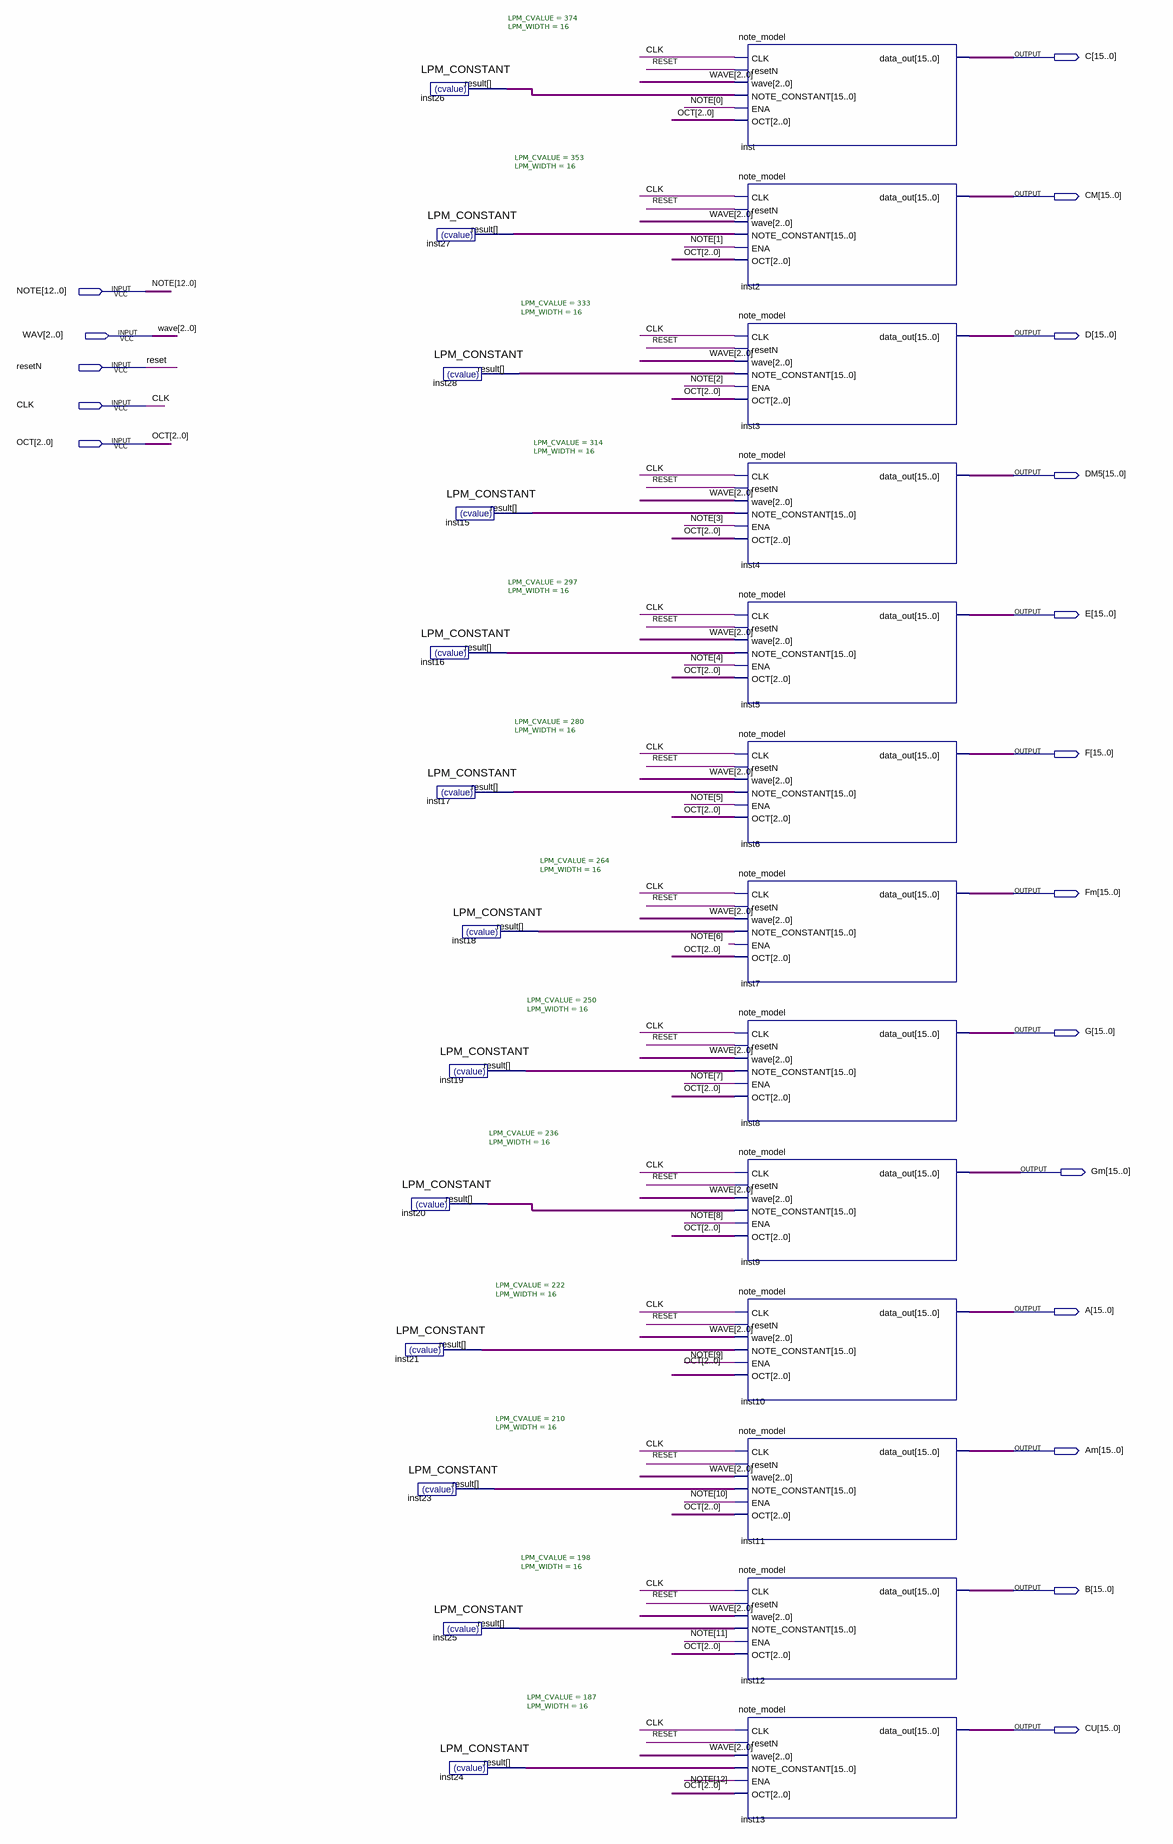
[diagram p0: schematic sheet]
// Quartus schematic PIANO_MOD_NEW.bdf as structural Verilog: 26 symbols, 18 pins
module PIANO_MOD_NEW (
  input  [12:0] NOTE,
  input  [2:0] WAV,
  input  resetN,
  input  CLK,
  input  [2:0] OCT,
  output [15:0] C,
  output [15:0] CM,
  output [15:0] D,
  output [15:0] DM5,
  output [15:0] E,
  output [15:0] F,
  output [15:0] Fm,
  output [15:0] G,
  output [15:0] Gm,
  output [15:0] A,
  output [15:0] Am,
  output [15:0] B,
  output [15:0] CU
);

  wire [15:0] inst15_result, inst16_result, inst17_result, inst18_result, inst19_result, inst20_result,
       inst21_result, inst23_result, inst24_result, inst25_result, inst26_result, inst27_result,
       inst28_result;

  LPM_CONSTANT #(.LPM_CVALUE(374), .LPM_WIDTH(16)) inst26 (.result(inst26_result));
  LPM_CONSTANT #(.LPM_CVALUE(297), .LPM_WIDTH(16)) inst16 (.result(inst16_result));
  LPM_CONSTANT #(.LPM_CVALUE(236), .LPM_WIDTH(16)) inst20 (.result(inst20_result));
  LPM_CONSTANT #(.LPM_CVALUE(222), .LPM_WIDTH(16)) inst21 (.result(inst21_result));
  LPM_CONSTANT #(.LPM_CVALUE(210), .LPM_WIDTH(16)) inst23 (.result(inst23_result));
  LPM_CONSTANT #(.LPM_CVALUE(353), .LPM_WIDTH(16)) inst27 (.result(inst27_result));
  LPM_CONSTANT #(.LPM_CVALUE(333), .LPM_WIDTH(16)) inst28 (.result(inst28_result));
  LPM_CONSTANT #(.LPM_CVALUE(314), .LPM_WIDTH(16)) inst15 (.result(inst15_result));
  LPM_CONSTANT #(.LPM_CVALUE(280), .LPM_WIDTH(16)) inst17 (.result(inst17_result));
  LPM_CONSTANT #(.LPM_CVALUE(264), .LPM_WIDTH(16)) inst18 (.result(inst18_result));
  LPM_CONSTANT #(.LPM_CVALUE(250), .LPM_WIDTH(16)) inst19 (.result(inst19_result));
  LPM_CONSTANT #(.LPM_CVALUE(198), .LPM_WIDTH(16)) inst25 (.result(inst25_result));
  LPM_CONSTANT #(.LPM_CVALUE(187), .LPM_WIDTH(16)) inst24 (.result(inst24_result));
  note_model inst (
    .CLK(CLK), .resetN(resetN), .wave(WAV), .NOTE_CONSTANT(inst26_result), .ENA(NOTE[0]), .OCT(OCT),
    .data_out(C));
  note_model inst2 (
    .CLK(CLK), .resetN(resetN), .wave(WAV), .NOTE_CONSTANT(inst27_result), .ENA(NOTE[1]), .OCT(OCT),
    .data_out(CM));
  note_model inst3 (
    .CLK(CLK), .resetN(resetN), .wave(WAV), .NOTE_CONSTANT(inst28_result), .ENA(NOTE[2]), .OCT(OCT),
    .data_out(D));
  note_model inst4 (
    .CLK(CLK), .resetN(resetN), .wave(WAV), .NOTE_CONSTANT(inst15_result), .ENA(NOTE[3]), .OCT(OCT),
    .data_out(DM5));
  note_model inst5 (
    .CLK(CLK), .resetN(resetN), .wave(WAV), .NOTE_CONSTANT(inst16_result), .ENA(NOTE[4]), .OCT(OCT),
    .data_out(E));
  note_model inst6 (
    .CLK(CLK), .resetN(resetN), .wave(WAV), .NOTE_CONSTANT(inst17_result), .ENA(NOTE[5]), .OCT(OCT),
    .data_out(F));
  note_model inst7 (
    .CLK(CLK), .resetN(resetN), .wave(WAV), .NOTE_CONSTANT(inst18_result), .ENA(NOTE[6]), .OCT(OCT),
    .data_out(Fm));
  note_model inst8 (
    .CLK(CLK), .resetN(resetN), .wave(WAV), .NOTE_CONSTANT(inst19_result), .ENA(NOTE[7]), .OCT(OCT),
    .data_out(G));
  note_model inst9 (
    .CLK(CLK), .resetN(resetN), .wave(WAV), .NOTE_CONSTANT(inst20_result), .ENA(NOTE[8]), .OCT(OCT),
    .data_out(Gm));
  note_model inst10 (
    .CLK(CLK), .resetN(resetN), .wave(WAV), .NOTE_CONSTANT(inst21_result), .ENA(NOTE[9]), .OCT(OCT),
    .data_out(A));
  note_model inst11 (
    .CLK(CLK), .resetN(resetN), .wave(WAV), .NOTE_CONSTANT(inst23_result), .ENA(NOTE[10]), .OCT(OCT),
    .data_out(Am));
  note_model inst12 (
    .CLK(CLK), .resetN(resetN), .wave(WAV), .NOTE_CONSTANT(inst25_result), .ENA(NOTE[11]), .OCT(OCT),
    .data_out(B));
  note_model inst13 (
    .CLK(CLK), .resetN(resetN), .wave(WAV), .NOTE_CONSTANT(inst24_result), .ENA(NOTE[12]), .OCT(OCT),
    .data_out(CU));

  // Other names for the same wires on the sheet: reset = resetN; WAVE[2:0] = WAV
endmodule
